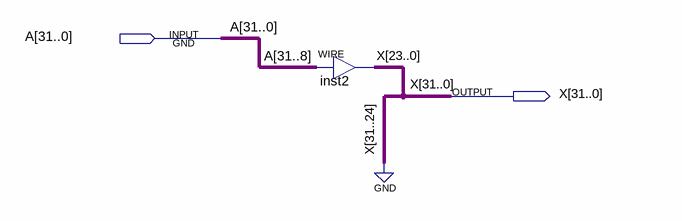
[diagram p0: schematic sheet]
// Quartus schematic shft8r32.bdf as structural Verilog: 1 symbols, 2 pins
module shft8r32 (
  input  [31:0] A,
  output [31:0] X
);

  assign X[23:0] = A[31:8];  // WIRE inst2

  assign X[31:24] = {8{1'b0}};
endmodule
